# EAGLE design BTP_Halleffectsensor (EAGLE 7.7.0)
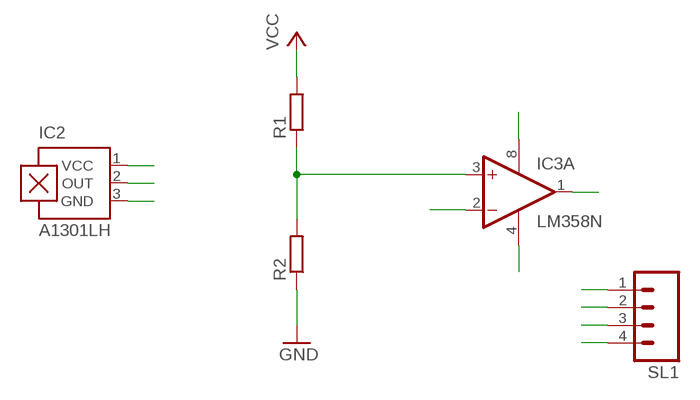
[diagram p0: schematic, sheet 1]

## Parts
IC2  A1301LH  [SOT23-W]
IC3  LM358N  [DIL08]
R1  R-EU_0204/7  [0204/7]
R2  R-EU_0204/7  [0204/7]
SL1  M04  [04P]

## Nets
DOUT: IC3.1(A:OUT) SL1.4
GND: IC2.3(GND) IC3.4(P:V-) R2.1 SL1.1
N$2: IC3.3(A:+IN) R1.1 R2.2
OUT: IC2.2(OUT) IC3.2(A:-IN) SL1.2
VCC: IC2.1(VCC) IC3.8(P:V+) R1.2 SL1.3
Unconnected: IC3.5(B:+IN) IC3.6(B:-IN) IC3.7(B:OUT)

## Library data of the parts
IC2 = allegro:A13*?: Linear Hall Effect Sensor ICs Continuous-Time Ratiometric High-Temperature Operation Programmable Linear with Analog Output A1302 -Replacement- UGN3503 Source: http://www.allegromicro.com/en/Products/Part_Numbers/1301/1301.pdf http://www.allegromicro.com/en/Products/Part_Numbers/1321/1321.pdf http://www.allegromicro.com/en/Products/Part_Numbers/1381/1381.pdf; MF: ALLEGRO MICROSYSTEMS, INC.; MPN: A1301ELHLT-T; OC_FARNELL: 1198084; OC_NEWARK: 31K6634
IC3 = CEDT_JANUARY_2015_v7:LM358: OP AMP also LM158; LM258; LM2904 Source: http://cache.national.com/ds/LM/LM158.pdf
R1 R2 = resistor:R-EU_: RESISTOR, European symbol
SL1 = con-amp-quick:M04: AMP QUICK CONNECTOR; OC_FARNELL: unknown; OC_NEWARK: unknown

## Board
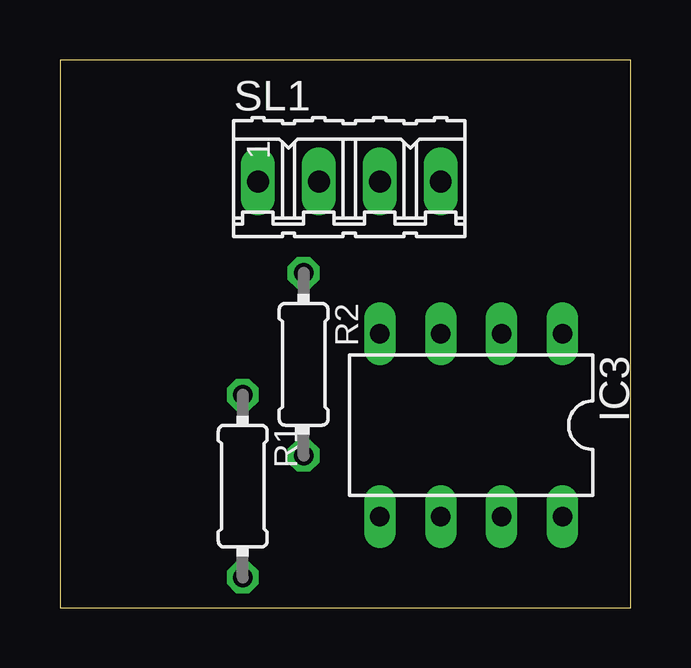
[diagram p1: board, top side]
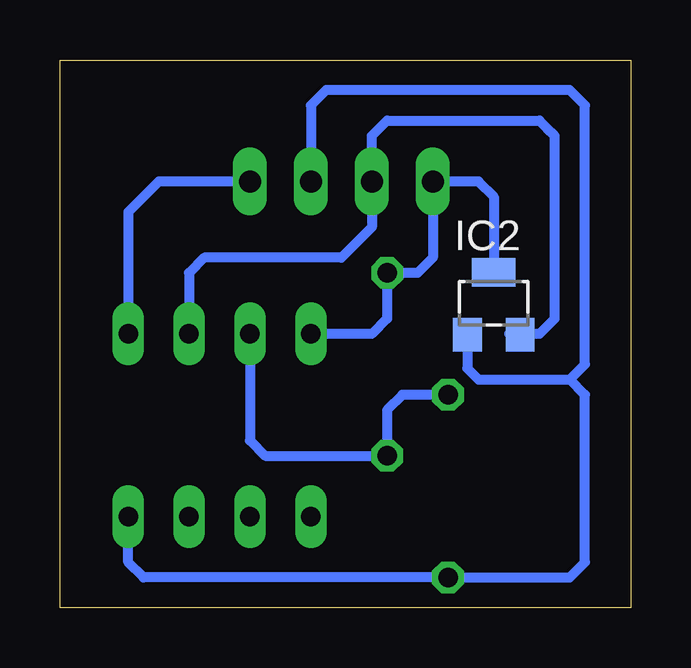
[diagram p2: board, bottom side, seen from below]

Size 23.8 x 22.85 mm. Coordinates in mm from the lower left corner, seen from the top.
Outline: 0,0 23.8,0 23.8,22.85 0,22.85 0,0
Copper layers (1*16): Top 0.035mm / dielectric 1.5mm / Bottom 0.035mm
Design rules "default": minimum track width 10mil, minimum drill 24mil, track to track 8mil, track to pad 8mil, pad to pad 8mil, via to via 8mil, smd to smd 8mil, copper to edge 40mil, drill to drill 8mil, minimum pad ring 10mil, minimum via ring 8mil, stop-mask expansion 4mil, vias tented up to drill 0mil, thermal gap 10mil

### Footprints (pad centres in the part's own frame; a part is rotated, then mirrored left to right if it is on the bottom)
SOT23-W = smd 1.2 x 1.4: 1 -1.1,-1.3; 2 1.1,-1.3 | smd 1.8 x 1.2: 3 0,1.3
DIL08 = drill 0.813 long: 1 -3.81,-3.81; 2 -1.27,-3.81; 3 1.27,-3.81; 4 3.81,-3.81; 5 3.81,3.81; 6 1.27,3.81; 7 -1.27,3.81; 8 -3.81,3.81
0204/7 = drill 0.813 octagon: 1 -3.81,0; 2 3.81,0
04P = drill 0.914 long: 1 -3.81,0; 2 -1.27,0; 3 1.27,0; 4 3.81,0

### Placement (x,y rotation side)
IC2  5.71,12.7 0 bottom
IC3  17.14,7.62 180 top
R1  7.62,5.08 270 top
R2  10.16,10.16 270 top
SL1  12.06,17.78 0 top

### Tracks (layer width: path | path; a pad name or v marks a point on that pad's centre or on a via)
DOUT
  Bottom 0.406: SL1.4 19.68,17.78 20.95,16.51 IC3.1
GND
  Bottom 0.406: IC2.3 5.71,17.14 6.35,17.78 7.62,17.78 8.26,17.14 | IC3.4 10.79,11.43 10.16,12.06 10.16,13.34 | 8.26,17.14 8.26,14.61 8.89,13.97 9.53,13.97 10.16,13.34 | 8.26,17.14 SL1.1 | 10.16,13.34 R2.1
N$2
  Bottom 0.406: IC3.3 15.88,6.99 15.24,6.35 R2.2 10.16,8.26 9.53,8.89 R1.1
OUT
  Bottom 0.406: 4.58,11.43 3.81,11.43 3.17,12.06 3.17,19.68 3.49,20 3.81,20.32 10.16,20.32 10.79,19.68 SL1.2 10.79,15.88 12.06,14.61 17.78,14.61 18.41,13.97 IC3.2 | 4.58,11.43 IC2.2 | 5.08,11.43 4.58,11.43
VCC
  Bottom 0.406: IC2.1 6.82,9.99 6.35,9.53 2.54,9.53 | 2.54,9.53 1.91,10.16 1.91,20.95 2.54,21.59 12.7,21.59 13.34,20.95 SL1.3 | IC3.8 20.95,1.91 20.32,1.27 R1.2 2.54,1.27 1.91,1.91 1.91,8.89 2.54,9.53